# Altium schematic sheet ME3116_5V.SchDoc
size A4; SheetNumber: 5; SheetTotal: 7
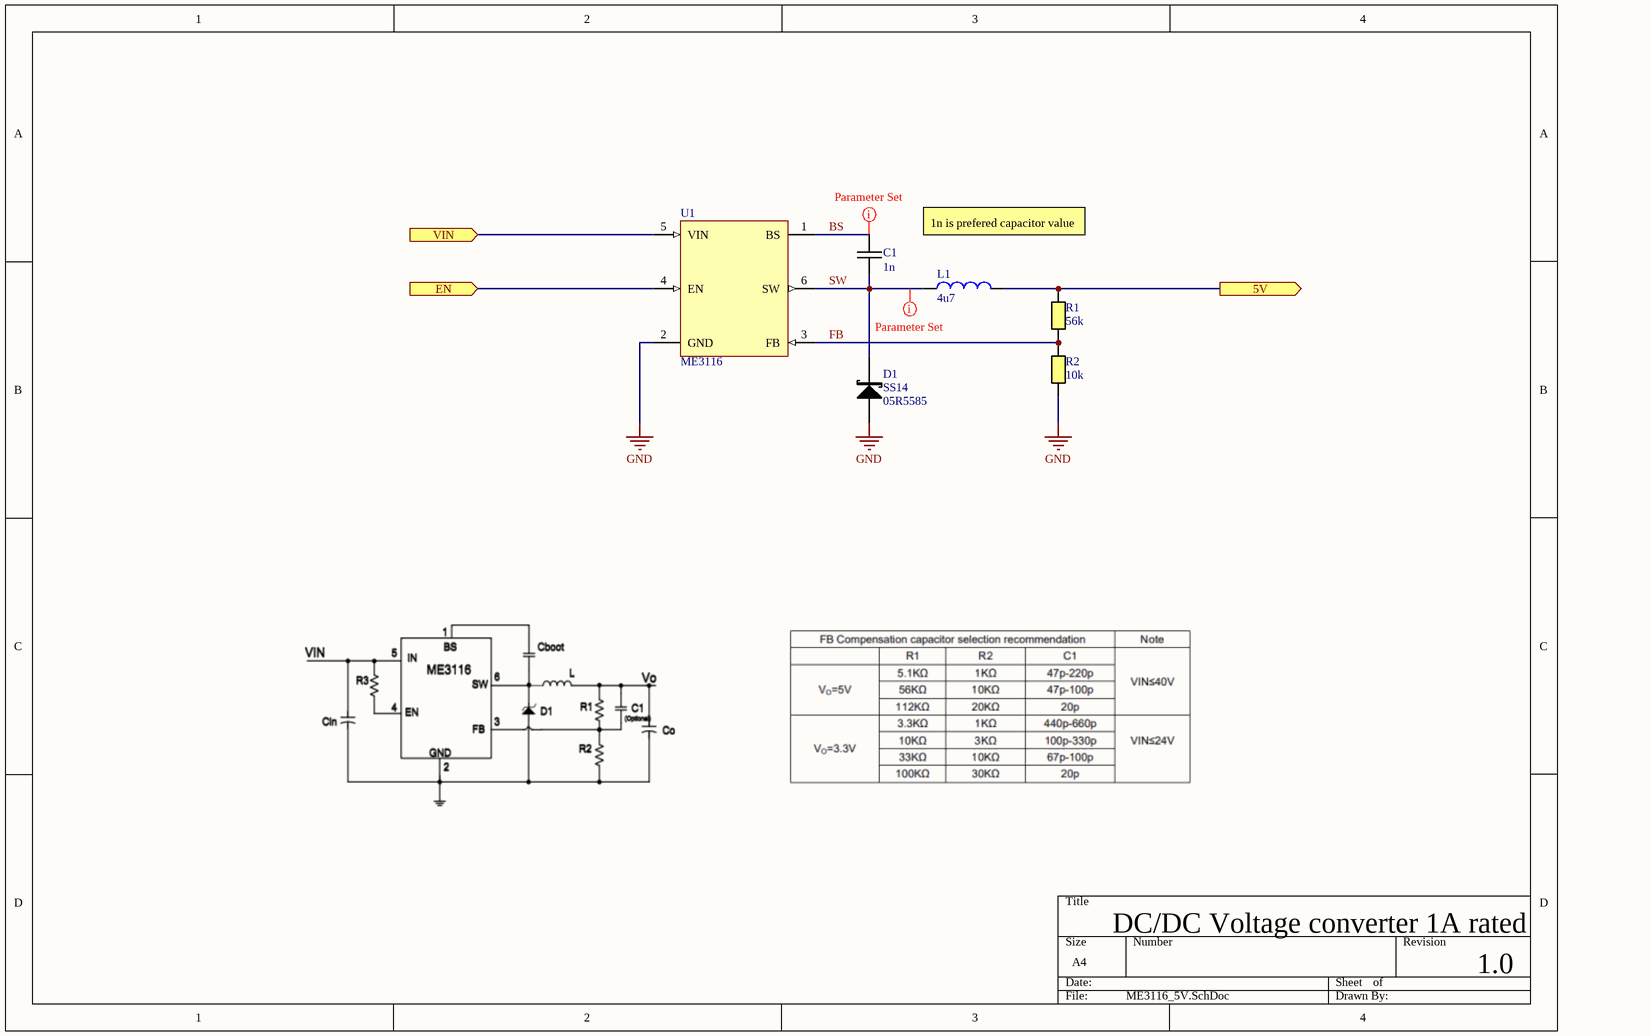
[diagram p0: ME3116_5V.SchDoc]

## Parts
C1  1n  [CAPC0603(1608)55_N]
D1  SS14  Supplier Part Number 1: 05R5585  [SMA]
L1  4u7  [CD32]
R1  56k  [RESC0603(1608)_N]
R2  10k  [RESC0603(1608)_N]
U1  ME3116  [SOT23-6]

## Ports
5V (out), EN (in), VIN (in)

## Nets
GND: D1.A R2.1 U1.2(GND)
5V: L1.2 R1.2 ; port 5V
BS: C1.1 U1.1(BS)
EN: U1.4(EN) ; port EN
FB: R1.1 R2.2 U1.3(FB)
SW: C1.2 D1.K L1.1 U1.6(SW)
VIN: U1.5(VIN) ; port VIN

## Layout directives
net class Direct: BS, SW

## Notes on the sheet
- 1n is prefered capacitor value
- DC/DC Voltage converter 1A rated
- 1.0

## Library data of the parts
C1 = Capacitor M: Ceramic capacitor Medium density; Value: 1n
D1 = SS14: Surface Mount Schottky Barrier Rectifier; If (av): 1.0A; Vrrm: 40V; Ifsm: 40A; Vf: 0.5 ~ 0.75V; Supplier 1: Newark
L1 = Inductor: Value: 4u7
R1 R2 = Resistor M: Resistor Medium Density
  R1: Value: 56k
  R2: Value: 10k
U1 = ME3116: The ME3116 is PWM DC/DC buck (step-down) regulators.; FB: 0.8V; Frequency: 550kHz; V in max: 45V